# Altium project E16-PDB.PrjPcb
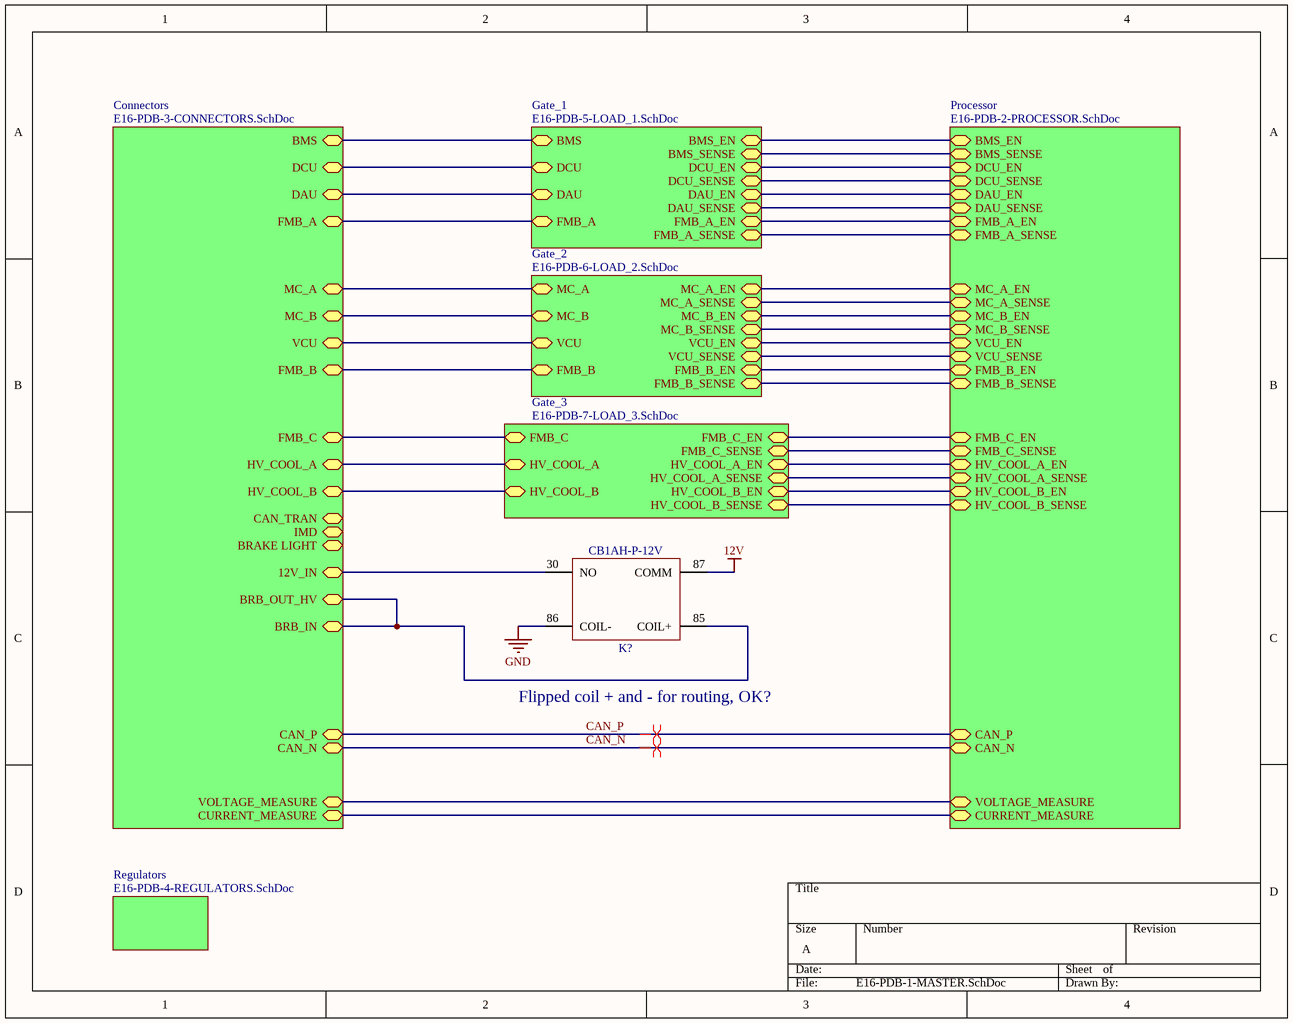
[diagram p0: E16-PDB-1-MASTER.SchDoc]
4 sheets, 55 parts. Net scope: hierarchical (ports join the sheet entries above them; power ports are global).
Board file: E16-PDB-PCB.PcbDoc
Sheets:
  E16-PDB-1-MASTER.SchDoc
    Processor = E16-PDB-2-PROCESSOR.SchDoc
    Gate_1 = E16-PDB-5-LOAD_1.SchDoc
    Gate_3 = E16-PDB-7-LOAD_3.SchDoc

## Sheet E16-PDB-1-MASTER.SchDoc
size A

### Parts
K?  CB1AH-P-12V  [CB1AH-P-12V]

### Sub-sheets
Connectors = E16-PDB-3-CONNECTORS.SchDoc (file not in this document): BMS, DCU, DAU, MC_A, MC_B, FMB_A, FMB_B, FMB_C, BRB_IN, IMD, BRAKE LIGHT, CAN_P, CAN_N, VOLTAGE_MEASURE, CURRENT_MEASURE, HV_COOL_A, HV_COOL_B, BRB_OUT_HV, 12V_IN, VCU, CAN_TRAN
Gate_1 = E16-PDB-5-LOAD_1.SchDoc: BMS, DCU, DAU, BMS_EN, DCU_EN, DAU_EN, BMS_SENSE, DCU_SENSE, DAU_SENSE, FMB_A, FMB_A_EN, FMB_A_SENSE
Gate_2 = E16-PDB-6-LOAD_2.SchDoc (file not in this document): MC_A, MC_B, MC_A_EN, MC_B_EN, MC_A_SENSE, MC_B_SENSE, FMB_B, FMB_B_EN, FMB_B_SENSE, VCU, VCU_EN, VCU_SENSE
Gate_3 = E16-PDB-7-LOAD_3.SchDoc: FMB_C, FMB_C_EN, FMB_C_SENSE, HV_COOL_A_SENSE, HV_COOL_A_EN, HV_COOL_B_SENSE, HV_COOL_B_EN, HV_COOL_A, HV_COOL_B
Processor = E16-PDB-2-PROCESSOR.SchDoc: BMS_EN, DCU_EN, DAU_EN, VCU_EN, MC_A_EN, MC_B_EN, FMB_A_EN, FMB_B_EN, FMB_C_EN, VOLTAGE_MEASURE, CURRENT_MEASURE, CAN_P, CAN_N, BMS_SENSE, DCU_SENSE, DAU_SENSE, VCU_SENSE, MC_A_SENSE, MC_B_SENSE, FMB_A_SENSE, FMB_B_SENSE, FMB_C_SENSE, HV_COOL_A_SENSE, HV_COOL_A_EN, HV_COOL_B_SENSE, HV_COOL_B_EN
Regulators = E16-PDB-4-REGULATORS.SchDoc (file not in this document): no entries

### Nets
12V: K?.87(COMM)
GND: K?.86(COIL-)
CAN_N: sheet Connectors/CAN_N, sheet Processor/CAN_N
CAN_P: sheet Connectors/CAN_P, sheet Processor/CAN_P
NetBMS_EN_1: sheet Processor/BMS_EN, sheet Gate_1/BMS_EN
NetDAU_EN_1: sheet Processor/DAU_EN, sheet Gate_1/DAU_EN
NetDCU_EN_1: sheet Processor/DCU_EN, sheet Gate_1/DCU_EN
NetF5_3: sheet Connectors/BMS, sheet Gate_1/BMS
NetF6_3: sheet Connectors/DCU, sheet Gate_1/DCU
NetF7_3: sheet Connectors/DAU, sheet Gate_1/DAU
NetF8_3: sheet Connectors/FMB_A, sheet Gate_1/FMB_A
NetF13_3: sheet Connectors/FMB_C, sheet Gate_3/FMB_C
NetF14_3: sheet Connectors/HV_COOL_A, sheet Gate_3/HV_COOL_A
NetF15_3: sheet Connectors/HV_COOL_B, sheet Gate_3/HV_COOL_B
NetFMB_A_EN_1: sheet Processor/FMB_A_EN, sheet Gate_1/FMB_A_EN
NetFMB_B_EN_1: sheet Processor/FMB_B_EN, sheet Gate_2/FMB_B_EN
NetFMB_C_EN_1: sheet Processor/FMB_C_EN, sheet Gate_3/FMB_C_EN
NetHVC_A_EN_1: sheet Processor/HV_COOL_A_EN, sheet Gate_3/HV_COOL_A_EN
NetHVC_B_EN_1: sheet Processor/HV_COOL_B_EN, sheet Gate_3/HV_COOL_B_EN
NetK?_30: K?.30(NO) ; sheet Connectors/12V_IN
NetK?_85: K?.85(COIL+) ; sheet Connectors/BRB_IN, sheet Connectors/BRB_OUT_HV
NetMC_A_EN_1: sheet Processor/MC_A_EN, sheet Gate_2/MC_A_EN
NetMC_B_EN_1: sheet Processor/MC_B_EN, sheet Gate_2/MC_B_EN
NetPB1_16: sheet Processor/BMS_SENSE, sheet Gate_1/BMS_SENSE
NetPB1_18: sheet Processor/DCU_SENSE, sheet Gate_1/DCU_SENSE
NetPB1_20: sheet Processor/DAU_SENSE, sheet Gate_1/DAU_SENSE
NetPB1_22: sheet Processor/FMB_A_SENSE, sheet Gate_1/FMB_A_SENSE
NetPB1_24: sheet Processor/MC_A_SENSE, sheet Gate_2/MC_A_SENSE
NetPB1_25: sheet Processor/VCU_EN, sheet Gate_2/VCU_EN
NetPB1_26: sheet Processor/MC_B_SENSE, sheet Gate_2/MC_B_SENSE
NetPB1_27: sheet Processor/HV_COOL_A_SENSE, sheet Gate_3/HV_COOL_A_SENSE
NetPB1_28: sheet Processor/VCU_SENSE, sheet Gate_2/VCU_SENSE
NetPB1_29: sheet Processor/HV_COOL_B_SENSE, sheet Gate_3/HV_COOL_B_SENSE
NetPB1_30: sheet Processor/FMB_B_SENSE, sheet Gate_2/FMB_B_SENSE
NetPB1_31: sheet Connectors/CURRENT_MEASURE, sheet Processor/CURRENT_MEASURE
NetPB1_32: sheet Processor/FMB_C_SENSE, sheet Gate_3/FMB_C_SENSE
NetPB1_33: sheet Connectors/VOLTAGE_MEASURE, sheet Processor/VOLTAGE_MEASURE
(unnamed): sheet Connectors/MC_A, sheet Gate_2/MC_A
(unnamed): sheet Connectors/MC_B, sheet Gate_2/MC_B
(unnamed): sheet Connectors/FMB_B, sheet Gate_2/FMB_B
(unnamed): sheet Connectors/VCU, sheet Gate_2/VCU

### Layout directives
differential pair: CAN_N, CAN_P

### Notes on the sheet
- Flipped coil + and - for routing, OK?

### Library data of the parts
K? = CB1AH-P-12V: Relay 12V 70A SPST; MFG: Panasonic Electric Works; Supplier 1: Digi-Key; Supplier Part Number 1: 255-2177-ND; MFG_PN: CB1AH-P-12V

## Sheet E16-PDB-2-PROCESSOR.SchDoc
size A4
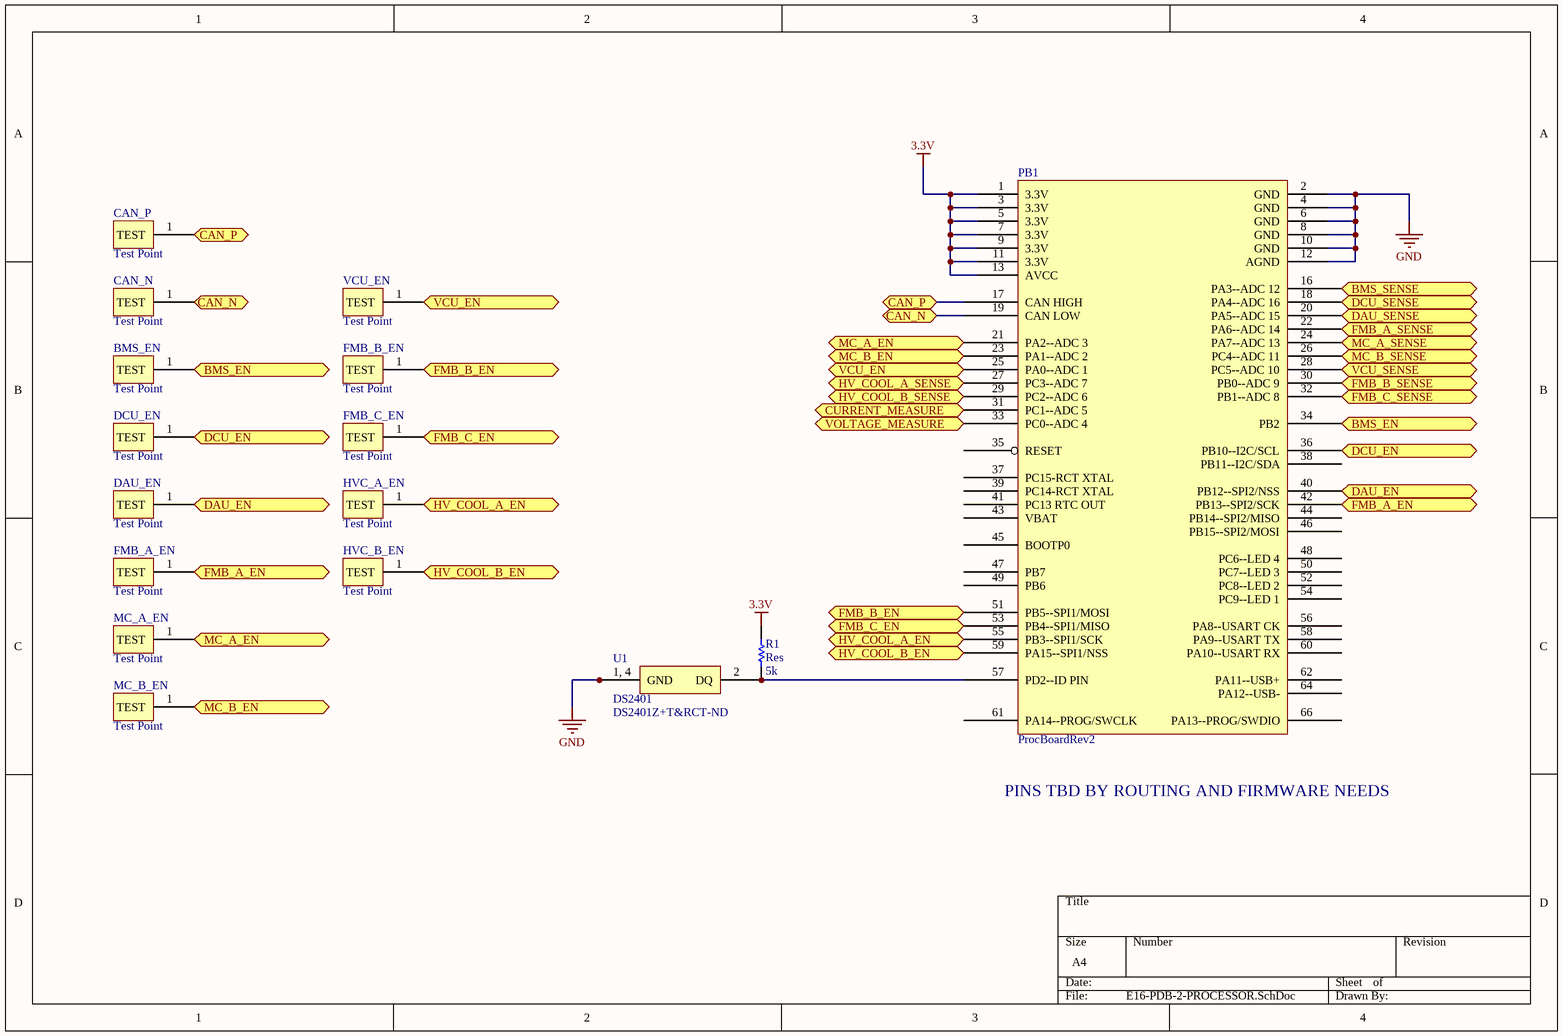
[diagram p1: E16-PDB-2-PROCESSOR.SchDoc]

### Parts
BMS_EN  Test Point  [TEST POINT 5000K]
CAN_N  Test Point  [TEST POINT 5000K]
CAN_P  Test Point  [TEST POINT 5000K]
DAU_EN  Test Point  [TEST POINT 5000K]
DCU_EN  Test Point  [TEST POINT 5000K]
FMB_A_EN  Test Point  [TEST POINT 5000K]
FMB_B_EN  Test Point  [TEST POINT 5000K]
FMB_C_EN  Test Point  [TEST POINT 5000K]
HVC_A_EN  Test Point  [TEST POINT 5000K]
HVC_B_EN  Test Point  [TEST POINT 5000K]
MC_A_EN  Test Point  [TEST POINT 5000K]
MC_B_EN  Test Point  [TEST POINT 5000K]
PB1  ProcBoardRev2  [PROC_BOARD]
R1  Res  value 5k  [2012[0805]]
U1  DS2401  Supplier Part Number 1: DS2401Z+T&RCT-ND  [SOT-223-3L]
VCU_EN  Test Point  [TEST POINT 5000K]

### Ports
BMS_EN, BMS_SENSE, CAN_N, CAN_P, CURRENT_MEASURE, DAU_EN, DAU_SENSE, DCU_EN, DCU_SENSE, FMB_A_EN, FMB_A_SENSE, FMB_B_EN, FMB_B_SENSE, FMB_C_EN, FMB_C_SENSE, HV_COOL_A_EN, HV_COOL_A_SENSE, HV_COOL_B_EN, HV_COOL_B_SENSE, MC_A_EN, MC_A_SENSE, MC_B_EN, MC_B_SENSE, VCU_EN, VCU_SENSE, VOLTAGE_MEASURE

### Nets
3.3V: PB1.1(3.3V) PB1.3(3.3V) PB1.5(3.3V) PB1.7(3.3V) PB1.9(3.3V) PB1.11(3.3V) PB1.13(AVCC) R1.2
GND: PB1.2(GND) PB1.4(GND) PB1.6(GND) PB1.8(GND) PB1.10(GND) PB1.12(AGND) U1.1(GND) U1.4(GND)
CAN_N: CAN_N.1(TEST) PB1.19(CAN_LOW) ; port CAN_N
CAN_P: CAN_P.1(TEST) PB1.17(CAN_HIGH) ; port CAN_P
NetBMS_EN_1: BMS_EN.1(TEST) PB1.34(PB2) ; port BMS_EN
NetDAU_EN_1: DAU_EN.1(TEST) PB1.40(PB12--SPI2/NSS) ; port DAU_EN
NetDCU_EN_1: DCU_EN.1(TEST) PB1.36(PB10--I2C/SCL) ; port DCU_EN
NetFMB_A_EN_1: FMB_A_EN.1(TEST) PB1.42(PB13--SPI2/SCK) ; port FMB_A_EN
NetFMB_B_EN_1: FMB_B_EN.1(TEST) PB1.51(PB5--SPI1/MOSI) ; port FMB_B_EN
NetFMB_C_EN_1: FMB_C_EN.1(TEST) PB1.53(PB4--SPI1/MISO) ; port FMB_C_EN
NetHVC_A_EN_1: HVC_A_EN.1(TEST) PB1.55(PB3--SPI1/SCK) ; port HV_COOL_A_EN
NetHVC_B_EN_1: HVC_B_EN.1(TEST) PB1.59(PA15--SPI1/NSS) ; port HV_COOL_B_EN
NetMC_A_EN_1: MC_A_EN.1(TEST) PB1.21(PA2--ADC_3) ; port MC_A_EN
NetMC_B_EN_1: MC_B_EN.1(TEST) PB1.23(PA1--ADC_2) ; port MC_B_EN
NetPB1_16: PB1.16(PA3--ADC_12) ; port BMS_SENSE
NetPB1_18: PB1.18(PA4--ADC_16) ; port DCU_SENSE
NetPB1_20: PB1.20(PA5--ADC_15) ; port DAU_SENSE
NetPB1_22: PB1.22(PA6--ADC_14) ; port FMB_A_SENSE
NetPB1_24: PB1.24(PA7--ADC_13) ; port MC_A_SENSE
NetPB1_25: PB1.25(PA0--ADC_1) VCU_EN.1(TEST) ; port VCU_EN
NetPB1_26: PB1.26(PC4--ADC_11) ; port MC_B_SENSE
NetPB1_27: PB1.27(PC3--ADC_7) ; port HV_COOL_A_SENSE
NetPB1_28: PB1.28(PC5--ADC_10) ; port VCU_SENSE
NetPB1_29: PB1.29(PC2--ADC_6) ; port HV_COOL_B_SENSE
NetPB1_30: PB1.30(PB0--ADC_9) ; port FMB_B_SENSE
NetPB1_31: PB1.31(PC1--ADC_5) ; port CURRENT_MEASURE
NetPB1_32: PB1.32(PB1--ADC_8) ; port FMB_C_SENSE
NetPB1_33: PB1.33(PC0--ADC_4) ; port VOLTAGE_MEASURE
NetPB1_57: PB1.57(PD2--ID_PIN) R1.1 U1.2(DQ)

Not connected (* = marked no-connect by the designer): PB1 14(NC) 15(NC) 35(RESET) 37(PC15-RCT_XTAL) 38(PB11--I2C/SDA) 39(PC14-RCT_XTAL) 41(PC13_RTC_OUT) 43(VBAT) 44(PB14--SPI2/MISO) 45(BOOTP0) 46(PB15--SPI2/MOSI) 47(PB7) 48(PC6--LED_4) 49(PB6) 50(PC7--LED_3) 52(PC8--LED_2) 54(PC9--LED_1) 56(PA8--USART_CK) 58(PA9--USART_TX) 60(PA10--USART_RX) 61(PA14--PROG/SWCLK) 62(PA11--USB+) 63(NC) 64(PA12--USB-) 65(NC) 66(PA13--PROG/SWDIO) 67

### Notes on the sheet
- PINS TBD BY ROUTING AND FIRMWARE NEEDS
- (in symbol DS2401) 1, 4

### Library data of the parts
BMS_EN CAN_N CAN_P DAU_EN DCU_EN FMB_A_EN FMB_B_EN FMB_C_EN HVC_A_EN HVC_B_EN MC_A_EN MC_B_EN VCU_EN = Test Point: 5000-5004, 5015-5019 Keystone Electronics
PB1 = ProcBoardRev2: Processor board that carries the STM32F072RB
R1 = Res: Surface Mount Resistor; Published: 8-Jun-2000; LatestRevisionDate: 17-Jul-2002; LatestRevisionNote: Re-released for DXP Platform.; PackageReference: AXIAL-0.5; Publisher: Altium Limited
U1 = DS2401: IC SILICON SERIAL NUMBER SOT223; Supplier 1: Digi-Key

## Sheet E16-PDB-5-LOAD_1.SchDoc
size A4
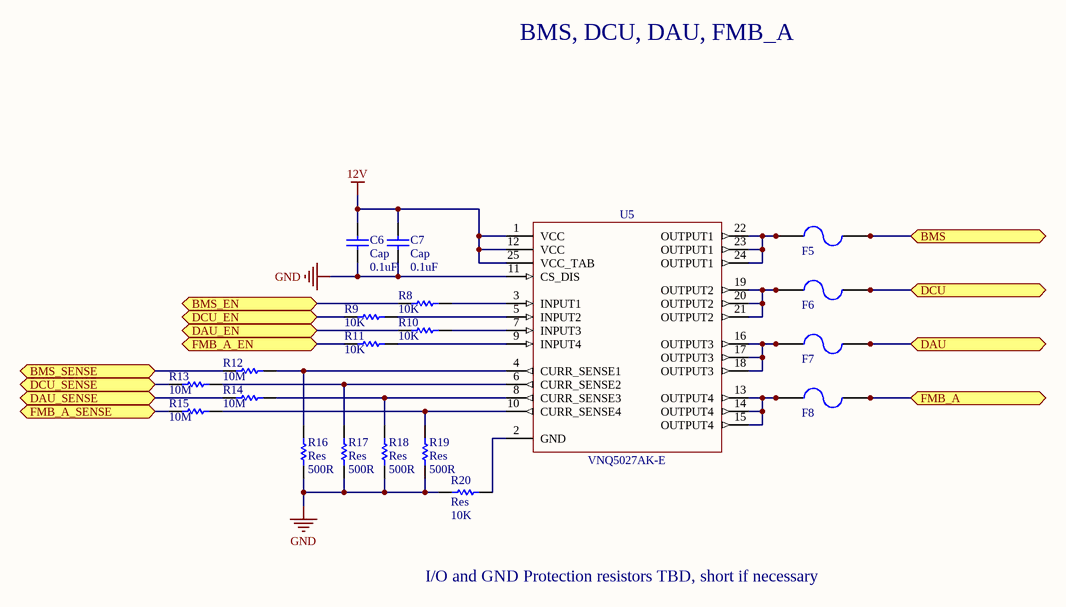
[diagram p2: E16-PDB-5-LOAD_1.SchDoc]

### Parts
C6  Cap  value 0.1uF  [C0805]
C7  Cap  value 0.1uF  [C0805]
F5  BK-6013  [BK-6013]  (value not drawn)
F6  BK-6013  [BK-6013]  (value not drawn)
F7  BK-6013  [BK-6013]  (value not drawn)
F8  BK-6013  [BK-6013]  (value not drawn)
R8  value 10K  [2012[0805]]  (hidden comment: Res)
R9  value 10K  [2012[0805]]  (hidden comment: Res)
R10  value 10K  [2012[0805]]  (hidden comment: Res)
R11  value 10K  [2012[0805]]  (hidden comment: Res)
R12  value 10M  [2012[0805]]  (hidden comment: Res)
R13  value 10M  [2012[0805]]  (hidden comment: Res)
R14  value 10M  [2012[0805]]  (hidden comment: Res)
R15  value 10M  [2012[0805]]  (hidden comment: Res)
R16  Res  value 500R  [2012[0805]]
R17  Res  value 500R  [2012[0805]]
R18  Res  value 500R  [2012[0805]]
R19  Res  value 500R  [2012[0805]]
R20  Res  value 10K  [2012[0805]]
U5  MFG_PN: VNQ5027AK-E  [PowerSSO-24]  (hidden comment: U_VNQ5027AK-E)

### Ports
BMS, BMS_EN, BMS_SENSE, DAU, DAU_EN, DAU_SENSE, DCU, DCU_EN, DCU_SENSE, FMB_A, FMB_A_EN, FMB_A_SENSE

### Nets
12V: C6.2 C7.2 U5.1(VCC) U5.12(VCC) U5.25(VCC_TAB)
GND: C6.1 C7.1 R16.1 R17.1 R18.1 R19.1 R20.2 U5.11(CS_DIS)
NetBMS_EN_1: R8.2 ; port BMS_EN
NetDAU_EN_1: R10.2 ; port DAU_EN
NetDCU_EN_1: R9.2 ; port DCU_EN
NetF5_1: F5.1 F5.2 U5.22(OUTPUT1) U5.23(OUTPUT1) U5.24(OUTPUT1)
NetF5_3: F5.3 F5.4 ; port BMS
NetF6_1: F6.1 F6.2 U5.19(OUTPUT2) U5.20(OUTPUT2) U5.21(OUTPUT2)
NetF6_3: F6.3 F6.4 ; port DCU
NetF7_1: F7.1 F7.2 U5.16(OUTPUT3) U5.17(OUTPUT3) U5.18(OUTPUT3)
NetF7_3: F7.3 F7.4 ; port DAU
NetF8_1: F8.1 F8.2 U5.13(OUTPUT4) U5.14(OUTPUT4) U5.15(OUTPUT4)
NetF8_3: F8.3 F8.4 ; port FMB_A
NetFMB_A_EN_1: R11.2 ; port FMB_A_EN
NetPB1_16: R12.2 ; port BMS_SENSE
NetPB1_18: R13.2 ; port DCU_SENSE
NetPB1_20: R14.2 ; port DAU_SENSE
NetPB1_22: R15.2 ; port FMB_A_SENSE
NetR8_1: R8.1 U5.3(INPUT1)
NetR9_1: R9.1 U5.5(INPUT2)
NetR10_1: R10.1 U5.7(INPUT3)
NetR11_1: R11.1 U5.9(INPUT4)
NetR12_1: R12.1 R16.2 U5.4(CURR_SENSE1)
NetR13_1: R13.1 R17.2 U5.6(CURR_SENSE2)
NetR14_1: R14.1 R18.2 U5.8(CURR_SENSE3)
NetR15_1: R15.1 R19.2 U5.10(CURR_SENSE4)
NetR20_1: R20.1 U5.2(GND)

### Notes on the sheet
- BMS, DCU, DAU, FMB_A
- I/O and GND Protection resistors TBD, short if necessary

### Library data of the parts
C6 C7 = Cap: Capacitor; Published: 8-Jun-2000; LatestRevisionDate: 17-Jul-2002; LatestRevisionNote: Re-released for DXP Platform.; PackageReference: C1206; Publisher: Altium Limited
F5-F8 = BK-6013: FUSE HOLDER BLADE PCB; Supplier 1: Digi-Key; Supplier Part Number 1: BK-6013-ND
R8-R20 = Res: Surface Mount Resistor; Published: 8-Jun-2000; LatestRevisionDate: 17-Jul-2002; LatestRevisionNote: Re-released for DXP Platform.; PackageReference: AXIAL-0.5; Publisher: Altium Limited
U5 = U_VNQ5027AK-E: LOAD CHANNEL HIGH SIDE 42 A 4 Channel; MFG: STmicroelectronics; Supplier 1: Digi-Key; Supplier Part Number 1: 497-11715-1-ND

## Sheet E16-PDB-7-LOAD_3.SchDoc
size A4
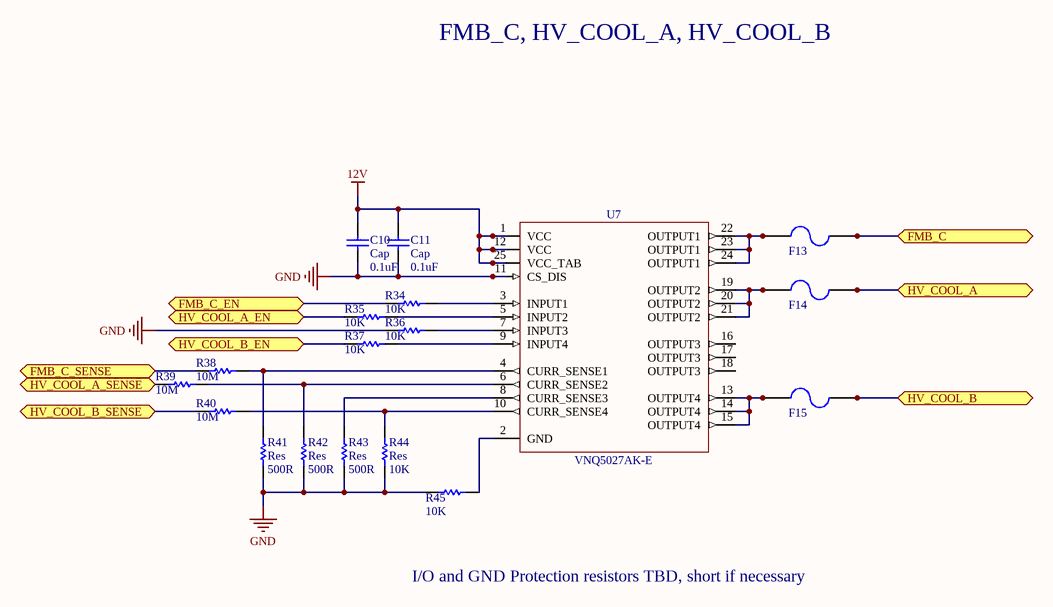
[diagram p3: E16-PDB-7-LOAD_3.SchDoc]

### Parts
C10  Cap  value 0.1uF  [C0805]
C11  Cap  value 0.1uF  [C0805]
F13  BK-6013  [BK-6013]  (value not drawn)
F14  BK-6013  [BK-6013]  (value not drawn)
F15  BK-6013  [BK-6013]  (value not drawn)
R34  value 10K  [2012[0805]]  (hidden comment: Res)
R35  value 10K  [2012[0805]]  (hidden comment: Res)
R36  value 10K  [2012[0805]]  (hidden comment: Res)
R37  value 10K  [2012[0805]]  (hidden comment: Res)
R38  value 10M  [2012[0805]]  (hidden comment: Res)
R39  value 10M  [2012[0805]]  (hidden comment: Res)
R40  value 10M  [2012[0805]]  (hidden comment: Res)
R41  Res  value 500R  [2012[0805]]
R42  Res  value 500R  [2012[0805]]
R43  Res  value 500R  [2012[0805]]
R44  Res  value 10K  [2012[0805]]
R45  value 10K  [2012[0805]]  (hidden comment: Res)
U7  MFG_PN: VNQ5027AK-E  [PowerSSO-24]  (hidden comment: U_VNQ5027AK-E)

### Ports
FMB_C, FMB_C_EN, FMB_C_SENSE, HV_COOL_A, HV_COOL_A_EN, HV_COOL_A_SENSE, HV_COOL_B, HV_COOL_B_EN, HV_COOL_B_SENSE

### Nets
12V: C10.2 C11.2 U7.1(VCC) U7.12(VCC) U7.25(VCC_TAB)
GND: C10.1 C11.1 R36.2 R41.1 R42.1 R43.1 R44.1 R45.2 U7.11(CS_DIS)
NetF13_1: F13.1 F13.2 U7.22(OUTPUT1) U7.23(OUTPUT1) U7.24(OUTPUT1)
NetF13_3: F13.3 F13.4 ; port FMB_C
NetF14_1: F14.1 F14.2 U7.19(OUTPUT2) U7.20(OUTPUT2) U7.21(OUTPUT2)
NetF14_3: F14.3 F14.4 ; port HV_COOL_A
NetF15_1: F15.1 F15.2 U7.13(OUTPUT4) U7.14(OUTPUT4) U7.15(OUTPUT4)
NetF15_3: F15.3 F15.4 ; port HV_COOL_B
NetFMB_C_EN_1: R34.2 ; port FMB_C_EN
NetHVC_A_EN_1: R35.2 ; port HV_COOL_A_EN
NetHVC_B_EN_1: R37.2 ; port HV_COOL_B_EN
NetPB1_27: R39.2 ; port HV_COOL_A_SENSE
NetPB1_29: R40.2 ; port HV_COOL_B_SENSE
NetPB1_32: R38.2 ; port FMB_C_SENSE
NetR34_1: R34.1 U7.3(INPUT1)
NetR35_1: R35.1 U7.5(INPUT2)
NetR36_1: R36.1 U7.7(INPUT3)
NetR37_1: R37.1 U7.9(INPUT4)
NetR38_1: R38.1 R41.2 U7.4(CURR_SENSE1)
NetR39_1: R39.1 R42.2 U7.6(CURR_SENSE2)
NetR40_1: R40.1 R44.2 U7.10(CURR_SENSE4)
NetR43_2: R43.2 U7.8(CURR_SENSE3)
NetR45_1: R45.1 U7.2(GND)

Not connected (* = marked no-connect by the designer): U7 16(OUTPUT3) 17(OUTPUT3) 18(OUTPUT3)

### Notes on the sheet
- FMB_C, HV_COOL_A, HV_COOL_B
- I/O and GND Protection resistors TBD, short if necessary

### Library data of the parts
C10 C11 = Cap: Capacitor; Published: 8-Jun-2000; LatestRevisionDate: 17-Jul-2002; LatestRevisionNote: Re-released for DXP Platform.; PackageReference: C1206; Publisher: Altium Limited
F13-F15 = BK-6013: FUSE HOLDER BLADE PCB; Supplier 1: Digi-Key; Supplier Part Number 1: BK-6013-ND
R34-R45 = Res: Surface Mount Resistor; Published: 8-Jun-2000; LatestRevisionDate: 17-Jul-2002; LatestRevisionNote: Re-released for DXP Platform.; PackageReference: AXIAL-0.5; Publisher: Altium Limited
U7 = U_VNQ5027AK-E: as U5 on sheet E16-PDB-5-LOAD_1; Supplier 1: Digi-Key; Supplier Part Number 1: 497-11715-1-ND

## Nets that join several sheets
12V: E16-PDB-1-MASTER (K?.87), E16-PDB-5-LOAD_1 (5 pins), E16-PDB-7-LOAD_3 (5 pins)
GND: E16-PDB-1-MASTER (K?.86), E16-PDB-2-PROCESSOR (8 pins), E16-PDB-5-LOAD_1 (8 pins), E16-PDB-7-LOAD_3 (9 pins)
NetBMS_EN_1: E16-PDB-2-PROCESSOR (BMS_EN.1 PB1.34), E16-PDB-5-LOAD_1 (R8.2)
NetDAU_EN_1: E16-PDB-2-PROCESSOR (DAU_EN.1 PB1.40), E16-PDB-5-LOAD_1 (R10.2)
NetDCU_EN_1: E16-PDB-2-PROCESSOR (DCU_EN.1 PB1.36), E16-PDB-5-LOAD_1 (R9.2)
NetFMB_A_EN_1: E16-PDB-2-PROCESSOR (FMB_A_EN.1 PB1.42), E16-PDB-5-LOAD_1 (R11.2)
NetFMB_C_EN_1: E16-PDB-2-PROCESSOR (FMB_C_EN.1 PB1.53), E16-PDB-7-LOAD_3 (R34.2)
NetHVC_A_EN_1: E16-PDB-2-PROCESSOR (HVC_A_EN.1 PB1.55), E16-PDB-7-LOAD_3 (R35.2)
NetHVC_B_EN_1: E16-PDB-2-PROCESSOR (HVC_B_EN.1 PB1.59), E16-PDB-7-LOAD_3 (R37.2)
NetPB1_16: E16-PDB-2-PROCESSOR (PB1.16), E16-PDB-5-LOAD_1 (R12.2)
NetPB1_18: E16-PDB-2-PROCESSOR (PB1.18), E16-PDB-5-LOAD_1 (R13.2)
NetPB1_20: E16-PDB-2-PROCESSOR (PB1.20), E16-PDB-5-LOAD_1 (R14.2)
NetPB1_22: E16-PDB-2-PROCESSOR (PB1.22), E16-PDB-5-LOAD_1 (R15.2)
NetPB1_27: E16-PDB-2-PROCESSOR (PB1.27), E16-PDB-7-LOAD_3 (R39.2)
NetPB1_29: E16-PDB-2-PROCESSOR (PB1.29), E16-PDB-7-LOAD_3 (R40.2)
NetPB1_32: E16-PDB-2-PROCESSOR (PB1.32), E16-PDB-7-LOAD_3 (R38.2)